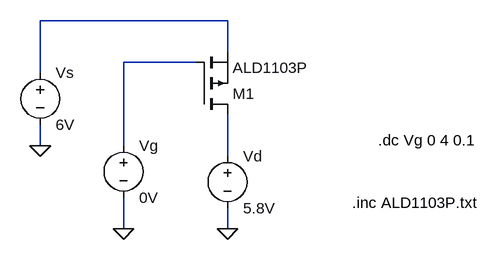
[diagram p0: schematic Exp3.asc]
Exp3.asc, the LTspice schematic file:
Version 4.1
SHEET 1 880 680
WIRE 272 32 -16 32
WIRE 272 80 272 32
WIRE 224 96 112 96
WIRE -16 112 -16 32
WIRE -16 224 -16 192
WIRE 112 224 112 96
WIRE 272 240 272 176
WIRE 112 352 112 304
WIRE 272 352 272 320
FLAG -16 224 0
FLAG 112 352 0
FLAG 272 352 0
SYMBOL pmos 224 176 M180
SYMATTR InstName M1
SYMATTR Value ALD1103P
SYMBOL voltage -16 96 R0
SYMATTR InstName Vs
SYMATTR Value 6V
SYMBOL voltage 112 208 R0
SYMATTR InstName Vg
SYMATTR Value 0V
SYMBOL voltage 272 224 R0
SYMATTR InstName Vd
SYMATTR Value 5.8V
TEXT 504 216 Left 2 !.dc Vg 0 4 0.1
TEXT 464 312 Left 2 !.inc ALD1103P.txt

The netlist it stands for:
* Exp3.asc
M1 N003 N002 N001 N001 ALD1103P
Vs N001 0 6V
Vg N002 0 0V
Vd N003 0 5.8V
.model NMOS NMOS
.model PMOS PMOS
.lib standard.mos
.dc Vg 0 4 0.1
.inc ALD1103P.txt
.backanno
.end

* Results of the author's LTspice run, read from the files saved beside the schematic
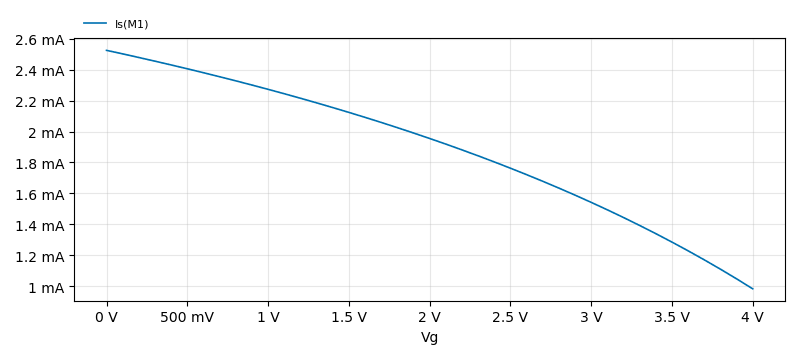
[diagram p1: DC transfer characteristic of Exp3.asc, plotted from the saved traces]
* DC transfer characteristic, 1 run:
*   Is(M1): 2.526 mA at Vg=0 V, 981.9 µA at Vg=4 V, min 981.9 µA, max 2.526 mA